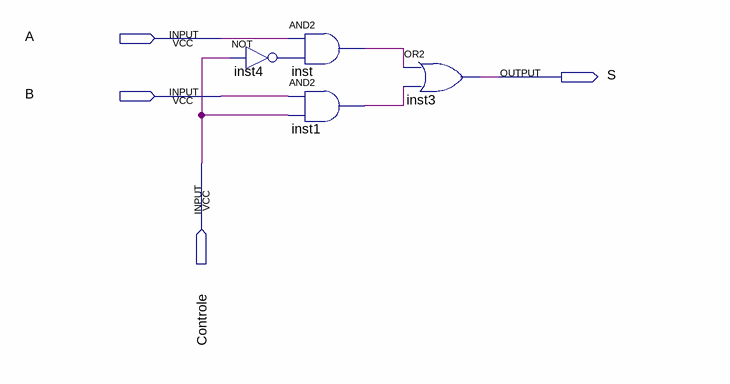
[diagram p0: schematic sheet]
// Quartus schematic Mux2X1.bdf as structural Verilog: 4 symbols, 4 pins
module Mux2X1 (
  input  A,
  input  B,
  input  Controle,
  output S
);

  wire inst1_out, inst4_out, inst_out;

  and inst (inst_out, A, inst4_out);
  not inst4 (inst4_out, Controle);
  and inst1 (inst1_out, B, Controle);
  or inst3 (S, inst_out, inst1_out);
endmodule
